# Altium schematic sheet Sheet1.SchDoc
size A3; SheetNumber: 1; SheetTotal: 3
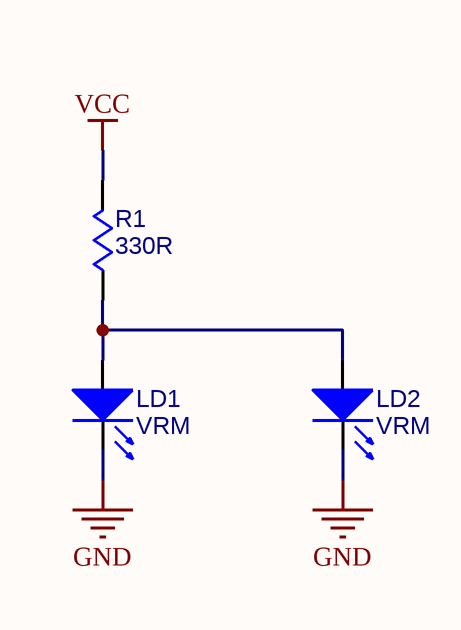
[diagram p0: Sheet1.SchDoc]

## Parts
LD1  VRM  [LED3-5-Q-WH]
LD2  VRM  [LED3-5-Q-WH]
R1  330R  [AXIAL-0.4]

## Nets
GND: LD1.K LD2.K
VCC: R1.2
NetLD1_A: LD1.A LD2.A R1.1

## Library data of the parts
LD1 LD2 = D.L.T.VERM.3MM.Q[LED3Q]: DIODO LED VERMELHO, THT, 3MM, QUADRADO; Manufacturer: SUN LED; MPN: XSMDK43MB; Complement: SQUARE, 3MM, THT; Microsiga: *CADASTRAR; Mounting Type: THT; Value: VRM
R1 = R.T.K.330.1/8W.1Q[AXIAL0.4]: RESISTOR THT DE FILME METAL 330R 0,125W 1% (AXIAL 0.4); Equivalent: MF0W8FF3300A20; Mounting Type: THT